# EAGLE design Gary-Repalcement (EAGLE 6.6.0)
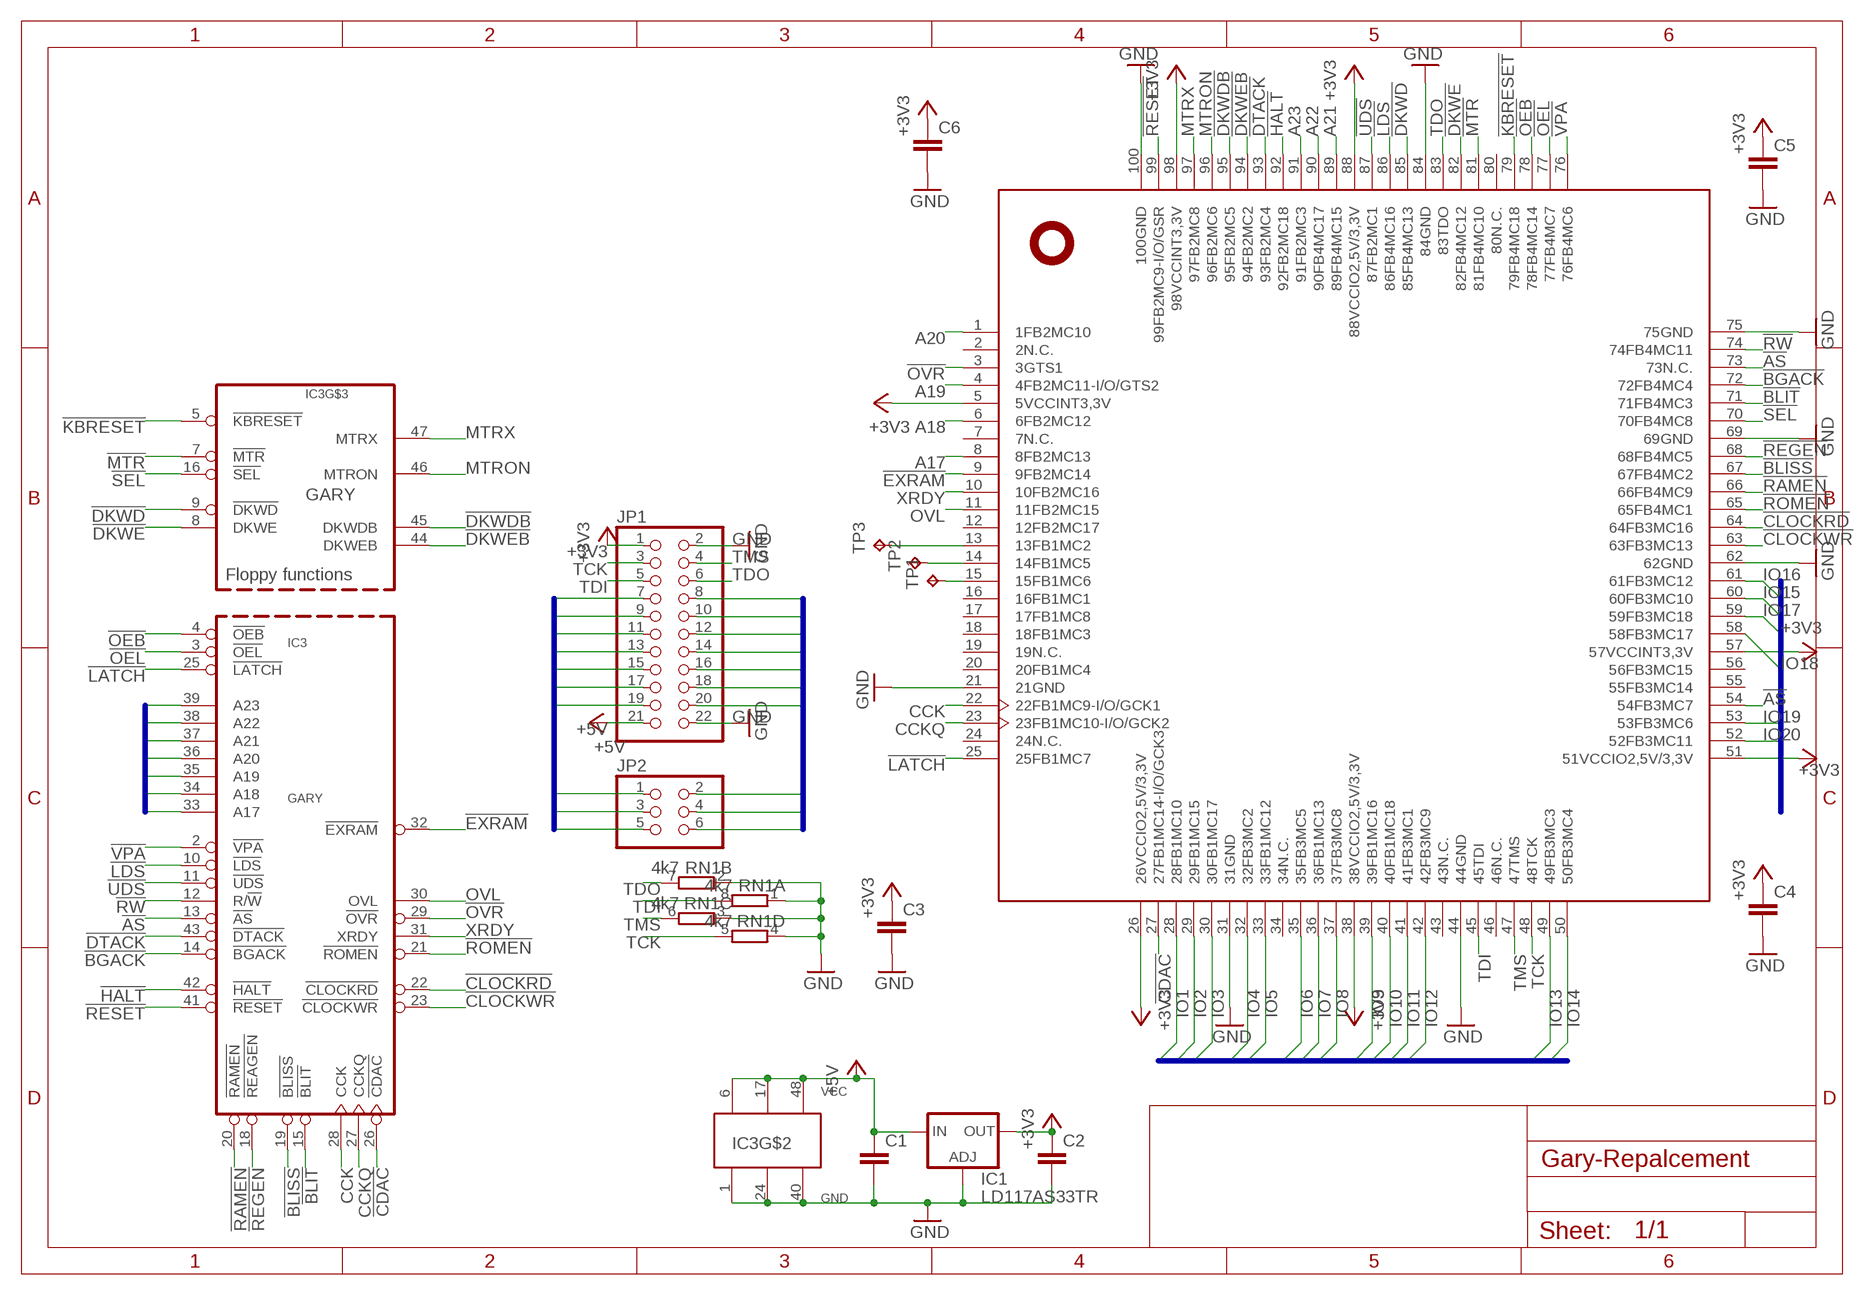
[diagram p0: schematic, sheet 1]

## Parts
C1  C-EUC0805K  [C0805K]
C2  C-EUC0805K  [C0805K]
C3  C-EUC0603  [C0603]
C4  C-EUC0603  [C0603]
C5  C-EUC0603  [C0603]
C6  C-EUC0603  [C0603]
IC1  LD117AS33TR  [SOT223]
IC2  XC9572XLTQ100  [TQ100]
IC3  GARY_DIP-LABELS  [DIP48-GARY]
JP1  PINHD-2X11  [2X11]
JP2  PINHD-2X3  [2X03]
RN1  4k7  4R-N0603-ARC  [0603-ARC]
TP1  TPB1,27  [B1,27]
TP2  TPB1,27  [B1,27]
TP3  TPB1,27  [B1,27]

## Nets
!AS: IC2.54(54FB3MC7) IC2.73(73N.C.) IC3.13(!AS)
!BGACK: IC2.72(72FB4MC4) IC3.14(!BGACK)
!BLISS: IC2.67(67FB4MC2) IC3.19(!BLISS)
!BLIT: IC2.71(71FB4MC3) IC3.15(!BLIT)
!CDAC: IC2.27(27FB1MC14-I/O/GCK3) IC3.26(!CDAC)
!CLOCKRD: IC2.64(64FB3MC16) IC3.22(!CLOCKRD)
!CLOCKWR: IC2.63(63FB3MC13) IC3.23(!CLOCKWR)
!DKWD: IC2.85(85FB4MC13) IC3.9(!DKWD)
!DKWDB: IC2.95(95FB2MC5) IC3.45(DKWDB)
!DKWE: IC2.82(82FB4MC12) IC3.8(DKWE)
!DKWEB: IC2.94(94FB2MC2) IC3.44(DKWEB)
!DTACK: IC2.93(93FB2MC4) IC3.43(!DTACK)
!EXRAM: IC2.9(9FB2MC14) IC3.32(!EXRAM)
!HALT: IC2.92(92FB2MC18) IC3.42(!HALT)
!KBRESET: IC2.79(79FB4MC18) IC3.5(!KBRESET)
!LATCH: IC2.25(25FB1MC7) IC3.25(!LATCH)
!LDS: IC2.86(86FB4MC16) IC3.10(!LDS)
!MTR: IC2.81(81FB4MC10) IC3.7(!MTR)
!OEB: IC2.78(78FB4MC14) IC3.4(!OEB)
!OEL: IC2.77(77FB4MC7) IC3.3(!OEL)
!OVR: IC2.3(3GTS1) IC3.29(!OVR)
!RAMEN: IC2.66(66FB4MC9) IC3.20(!RAMEN)
!REGEN: IC2.68(68FB4MC5) IC3.18(!REAGEN)
!RESET: IC2.99(99FB2MC9-I/O/GSR) IC3.41(!RESET)
!ROMEN: IC2.65(65FB4MC1) IC3.21(!ROMEN)
!RW: IC2.74(74FB4MC11) IC3.12(R/!W!)
!SEL: IC2.70(70FB4MC8) IC3.16(!SEL)
!UDS: IC2.87(87FB2MC1) IC3.11(!UDS)
!VPA: IC2.76(76FB4MC6) IC3.2(!VPA)
+3V3: C2.1 C3.1 C4.1 C5.1 C6.1 IC1.2(OUT) IC1.4(OUT) IC2.5(5VCCINT3,3V) IC2.26(26VCCIO2,5V/3,3V) IC2.38(38VCCIO2,5V/3,3V) IC2.51(51VCCIO2,5V/3,3V) IC2.57(57VCCINT3,3V) IC2.88(88VCCIO2,5V/3,3V) IC2.98(98VCCINT3,3V) JP1.1
+5V: C1.1 IC1.3(IN) IC3.6(VCC) IC3.17(VCC) IC3.48(VCC) JP1.21
A17: IC2.8(8FB2MC13) IC3.33(A17)
A18: IC2.6(6FB2MC12) IC3.34(A18)
A19: IC2.4(4FB2MC11-I/O/GTS2) IC3.35(A19)
A20: IC2.1(1FB2MC10) IC3.36(A20)
A21: IC2.89(89FB4MC15) IC3.37(A21)
A22: IC2.90(90FB4MC17) IC3.38(A22)
A23: IC2.91(91FB2MC3) IC3.39(A23)
CCK: IC2.22(22FB1MC9-I/O/GCK1) IC3.28(CCK)
CCKQ: IC2.23(23FB1MC10-I/O/GCK2) IC3.27(CCKQ)
GND: C1.2 C2.2 C3.2 C4.2 C5.2 C6.2 IC1.1(ADJ) IC2.21(21GND) IC2.31(31GND) IC2.44(44GND) IC2.62(62GND) IC2.69(69GND) IC2.75(75GND) IC2.84(84GND) IC2.100(100GND) IC3.1(GND) IC3.24(GND) IC3.40(GND) JP1.2 JP1.22 RN1.1 RN1.2 RN1.3 RN1.4
IO1: IC2.28(28FB1MC10) JP1.19
IO2: IC2.29(29FB1MC15) JP1.20
IO3: IC2.30(30FB1MC17) JP1.17
IO4: IC2.32(32FB3MC2) JP1.18
IO5: IC2.33(33FB1MC12) JP1.15
IO6: IC2.35(35FB3MC5) JP1.16
IO7: IC2.36(36FB1MC13) JP1.13
IO8: IC2.37(37FB3MC8) JP1.14
IO9: IC2.39(39FB1MC16) JP1.11
IO10: IC2.40(40FB1MC18) JP1.12
IO11: IC2.41(41FB3MC1) JP1.9
IO12: IC2.42(42FB3MC9) JP1.10
IO13: IC2.49(49FB3MC3) JP1.7
IO14: IC2.50(50FB3MC4) JP1.8
IO15: IC2.60(60FB3MC10) JP2.2
IO16: IC2.61(61FB3MC12) JP2.1
IO17: IC2.59(59FB3MC18) JP2.4
IO18: IC2.58(58FB3MC17) JP2.3
IO19: IC2.53(53FB3MC6) JP2.6
IO20: IC2.52(52FB3MC11) JP2.5
MTRON: IC2.96(96FB2MC6) IC3.46(MTRON)
MTRX: IC2.97(97FB2MC8) IC3.47(MTRX)
N$1: IC2.15(15FB1MC6) TP1.TP
N$2: IC2.14(14FB1MC5) TP2.TP
N$3: IC2.13(13FB1MC2) TP3.TP
OVL: IC2.11(11FB2MC15) IC3.30(OVL)
TCK: IC2.48(48TCK) JP1.3 RN1.5
TDI: IC2.45(45TDI) JP1.5 RN1.8
TDO: IC2.83(83TDO) JP1.6 RN1.7
TMS: IC2.47(47TMS) JP1.4 RN1.6
XRDY: IC2.10(10FB2MC16) IC3.31(XRDY)
Unconnected: IC2.2(2N.C.) IC2.7(7N.C.) IC2.12(12FB2MC17) IC2.16(16FB1MC1) IC2.17(17FB1MC8) IC2.18(18FB1MC3) IC2.19(19N.C.) IC2.20(20FB1MC4) IC2.24(24N.C.) IC2.34(34N.C.) IC2.43(43N.C.) IC2.46(46N.C.) IC2.55(55FB3MC14) IC2.56(56FB3MC15) IC2.80(80N.C.)

## Buses
A[1..23]
IO[1..20]

## Library data of the parts
C1-C6 = rcl:C-EU: CAPACITOR, European symbol
IC1 = v-reg:LD117A?*: Low drop fixed and adjustable positive voltage regulators 1 A Source: http://www.st.com/stonline/products/literature/ds/7194/ld1117axx.pdf
IC2 = xilinx_xc9572xl-tq100:XC9572XLTQ100
IC3 = Amiga:GARY
JP1 = pinhead:PINHD-2X11: PIN HEADER
JP2 = pinhead:PINHD-2X3: PIN HEADER
RN1 = resistor-dil:4R-N: Array Chip Resistor Source: RS Component / Phycomp; OC_FARNELL: unknown; OC_NEWARK: unknown
TP1-TP3 = testpad:TP: Test pad

## Board
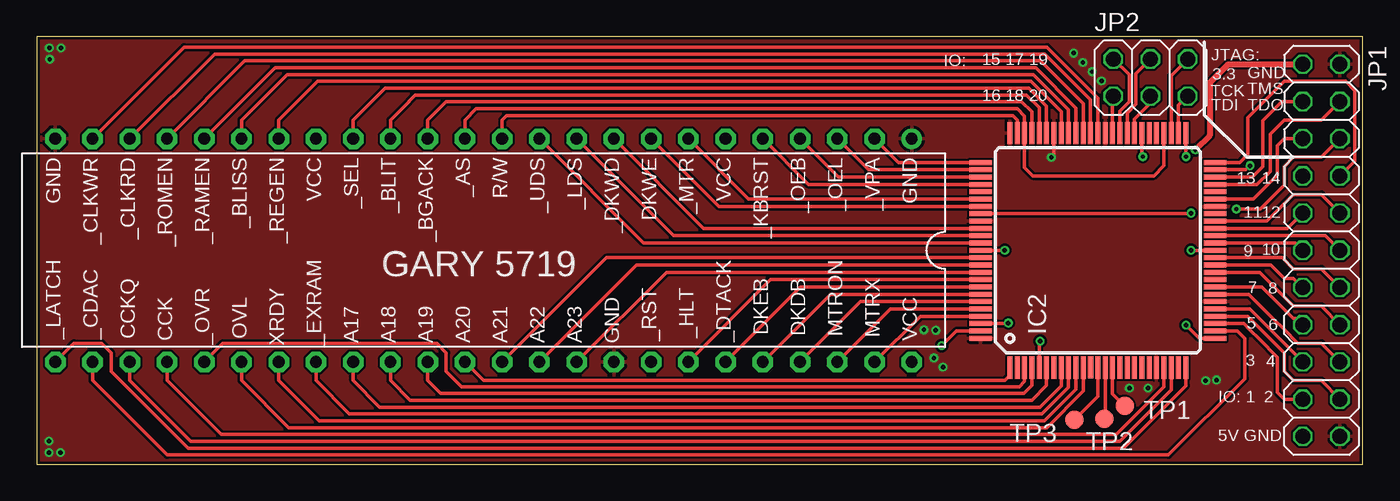
[diagram p1: board, top side]
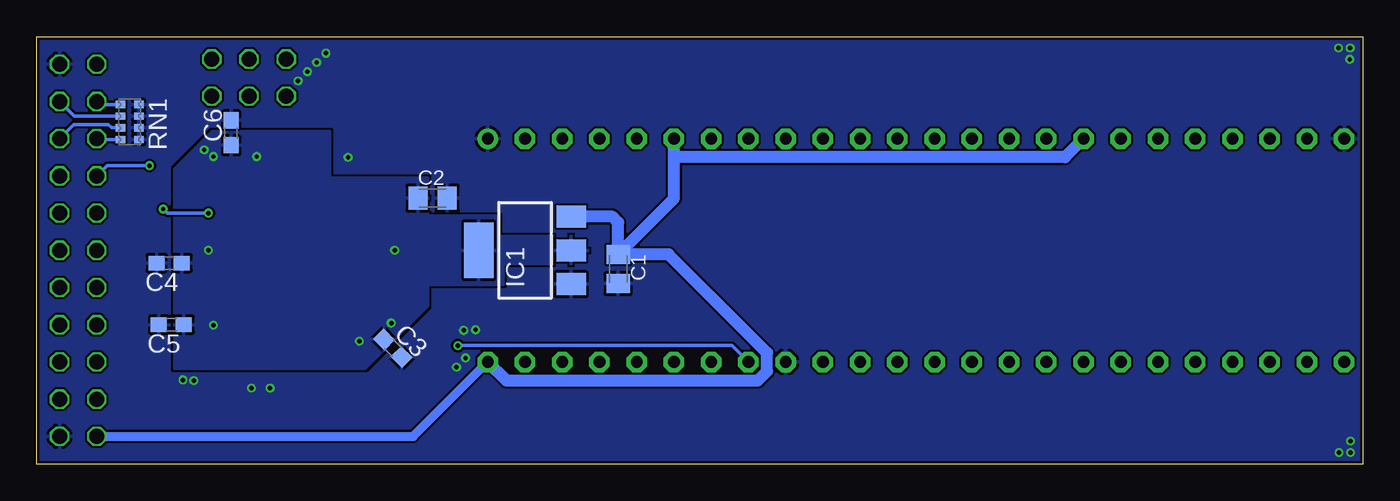
[diagram p2: board, bottom side, seen from below]

Size 90.46 x 29.19 mm. Coordinates in mm from the lower left corner, seen from the top.
Outline: 0,0 90.46,0 90.46,29.19 0,29.19 0,0
Copper layers (1*16): Top 0.035mm / dielectric 1.5mm / Bottom 0.035mm
Design rules "Eagle-DRU - 1506 - LeitOn - 01 and 02 layers - STANDARD": minimum track width 0.15mm, minimum drill 0.3mm, track to track 0.15mm, track to pad 0.15mm, pad to pad 0.15mm, via to via 0.15mm, smd to smd 0.15mm, copper to edge 0.2mm, drill to drill 0.25mm, minimum pad ring 0.15mm, minimum via ring 0.15mm, stop-mask expansion 0.05mm, vias tented up to drill 0mil, thermal gap 0.2mm

### Footprints (pad centres in the part's own frame; a part is rotated, then mirrored left to right if it is on the bottom)
C0805K = smd 1.3 x 1.6: 1 -1,0; 2 1,0
C0603 = smd 1.1 x 1: 1 -0.85,0; 2 0.85,0
SOT223 = smd 1.5 x 2: 1 -2.3,-3.15; 2 0,-3.15; 3 2.3,-3.15 | smd 3.8 x 2: 4 0,3.15
TQ100 = smd 1.524 x 0.343: 1 -4.19,3.46; 2 -4.19,2.96; 3 -4.19,2.46; 4 -4.19,1.96; 5 -4.19,1.46; 6 -4.19,0.96; 7 -4.19,0.46; 8 -4.19,-0.04; 9 -4.19,-0.54; 10 -4.19,-1.04; 11 -4.19,-1.54; 13 -4.19,-2.54; 14 -4.19,-3.04; 15 -4.19,-3.54; 16 -4.19,-4.04; 17 -4.19,-4.54; 18 -4.19,-5.04; 19 -4.19,-5.54; 20 -4.19,-6.04; 21 -4.19,-6.54; 22 -4.19,-7.04; 23 -4.19,-7.54; 24 -4.19,-8.04; 25 -4.19,-8.54; 51 11.81,-8.54; 52 11.81,-8.04; 53 11.81,-7.54; 54 11.81,-7.04; 55 11.81,-6.54; 56 11.81,-6.04; 57 11.81,-5.54; 58 11.81,-5.04; 59 11.81,-4.54; 60 11.81,-4.04; 61 11.81,-3.54; 62 11.81,-3.04; 63 11.81,-2.54; 64 11.81,-2.04; 65 11.81,-1.54; 66 11.81,-1.04; 67 11.81,-0.54; 68 11.81,-0.04; 69 11.81,0.46; 70 11.81,0.96; 71 11.81,1.46; 72 11.81,1.96; 73 11.81,2.46; 74 11.81,2.96; 75 11.81,3.46 | smd 1.5 x 0.35: 12 -4.19,-2.04 | smd 0.343 x 1.524: 26 -2.19,-10.54; 27 -1.69,-10.54; 28 -1.19,-10.54; 29 -0.69,-10.54; 30 -0.19,-10.54; 31 0.31,-10.54; 32 0.81,-10.54; 33 1.31,-10.54; 34 1.81,-10.54; 35 2.31,-10.54; 36 2.81,-10.54; 37 3.31,-10.54; 38 3.81,-10.54; 39 4.31,-10.54; 40 4.81,-10.54; 41 5.31,-10.54; 42 5.81,-10.54; 43 6.31,-10.54; 44 6.81,-10.54; 45 7.31,-10.54; 46 7.81,-10.54; 47 8.31,-10.54; 48 8.81,-10.54; 49 9.31,-10.54; 50 9.81,-10.54; 76 9.81,5.46; 77 9.31,5.46; 78 8.81,5.46; 79 8.31,5.46; 80 7.81,5.46; 81 7.31,5.46; 82 6.81,5.46; 83 6.31,5.46; 84 5.81,5.46; 85 5.31,5.46; 86 4.81,5.46; 87 4.31,5.46; 88 3.81,5.46; 89 3.31,5.46; 90 2.81,5.46; 91 2.31,5.46; 92 1.81,5.46; 93 1.31,5.46; 94 0.81,5.46; 95 0.31,5.46; 96 -0.19,5.46; 97 -0.69,5.46; 98 -1.19,5.46; 99 -1.69,5.46; 100 -2.19,5.46
DIP48-GARY = drill 0.8 pad 1.4: 1 -29.21,-7.62 | drill 0.8 pad 1.4 octagon: 2 -26.67,-7.62; 3 -24.13,-7.62; 4 -21.59,-7.62; 5 -19.05,-7.62; 6 -16.51,-7.62; 7 -13.97,-7.62; 8 -11.43,-7.62; 9 -8.89,-7.62; 10 -6.35,-7.62; 11 -3.81,-7.62; 12 -1.27,-7.62; 13 1.27,-7.62; 14 3.81,-7.62; 15 6.35,-7.62; 16 8.89,-7.62; 17 11.43,-7.62; 18 13.97,-7.62; 19 16.51,-7.62; 20 19.05,-7.62; 21 21.59,-7.62; 22 24.13,-7.62; 23 26.67,-7.62; 24 29.21,-7.62; 25 29.21,7.62; 26 26.67,7.62; 27 24.13,7.62; 28 21.59,7.62; 29 19.05,7.62; 30 16.51,7.62; 31 13.97,7.62; 32 11.43,7.62; 33 8.89,7.62; 34 6.35,7.62; 35 3.81,7.62; 36 1.27,7.62; 37 -1.27,7.62; 38 -3.81,7.62; 39 -6.35,7.62; 40 -8.89,7.62; 41 -11.43,7.62; 42 -13.97,7.62; 43 -16.51,7.62; 44 -19.05,7.62; 45 -21.59,7.62; 46 -24.13,7.62; 47 -26.67,7.62; 48 -29.21,7.62
2X11 = drill 1.016 octagon: 1 -12.7,-1.27; 2 -12.7,1.27; 3 -10.16,-1.27; 4 -10.16,1.27; 5 -7.62,-1.27; 6 -7.62,1.27; 7 -5.08,-1.27; 8 -5.08,1.27; 9 -2.54,-1.27; 10 -2.54,1.27; 11 0,-1.27; 12 0,1.27; 13 2.54,-1.27; 14 2.54,1.27; 15 5.08,-1.27; 16 5.08,1.27; 17 7.62,-1.27; 18 7.62,1.27; 19 10.16,-1.27; 20 10.16,1.27; 21 12.7,-1.27; 22 12.7,1.27
2X03 = drill 1.016 octagon: 1 -2.54,-1.27; 2 -2.54,1.27; 3 0,-1.27; 4 0,1.27; 5 2.54,-1.27; 6 2.54,1.27
0603-ARC = smd 0.5 x 0.65: 1 -1.2,-0.625; 2 -0.4,-0.625; 3 0.4,-0.625; 4 1.2,-0.625; 5 1.2,0.625; 6 0.4,0.625; 7 -0.4,0.625; 8 -1.2,0.625
B1,27 = smd 1.27 x 1.27: TP 0,0

### Placement (x,y rotation side)
C1  50.8,13.34 270 bottom
C2  63.46,18.17 0 bottom
C3  66.17,7.92 315 bottom
C4  81.42,13.73 180 bottom
C5  81.28,9.53 180 bottom
C6  77.19,22.63 90 bottom
IC1  57.15,14.61 90 bottom
IC2  69.85,10.79 90 top
IC3  30.48,14.61 180 top
JP1  87.63,14.61 270 top
JP2  75.97,26.39 0 top
RN1  84.12,23.36 90 bottom
TP1  74.22,3.98 0 top
TP2  72.82,3.11 0 top
TP3  70.8,3.05 0 top

### Tracks (layer width: path | path; a pad name or v marks a point on that pad's centre or on a via)
!AS
  Top 0.254: IC3.13 29.21,23.5 29.98,24.27 66.9,24.27 67.39,23.78 IC2.73 67.39,20.24 67.94,19.68 76.2,19.68 76.89,20.38 IC2.54
!BGACK
  Top 0.254: IC3.14 26.67,23.5 27.94,24.77 67.18,24.77 67.89,24.05 IC2.72
!BLISS
  Top 0.254: IC3.19 13.97,23.5 17.08,26.6 67.99,26.6 70.39,24.2 IC2.67
!BLIT
  Top 0.254: IC3.15 24.13,23.5 25.4,24.77 25.4,24.78 25.82,25.2 67.52,25.2 68.39,24.33 IC2.71
!CDAC
  Top 0.254: IC3.26 3.81,5.71 8.89,0.64 77.21,0.64 82.42,5.84 82.42,8.59 81.91,9.11 IC2.27
!CLOCKRD
  Top 0.254: IC3.22 12.13,28 68.76,28 71.89,24.88 IC2.64
!CLOCKWR
  Top 0.254: IC3.23 10.05,28.47 68.92,28.47 72.39,25 IC2.63
!DKWD
  Top 0.254: IC2.85 45.49,16.11 IC3.9
!DKWDB
  Top 0.254: IC2.95 56.19,11.11 IC3.45
!DKWE
  Top 0.254: IC3.8 46.53,17.61 IC2.82
!DKWEB
  Top 0.254: IC2.94 54.15,11.61 IC3.44
!DTACK
  Top 0.254: IC2.93 52.11,12.11 IC3.43
!EXRAM
  Top 0.254: IC2.9 70.39,5.24 68.58,3.44 21.33,3.44 19.05,5.71 IC3.32
!HALT
  Top 0.254: IC2.92 50.07,12.61 IC3.42
!KBRESET
  Top 0.254: IC3.5 52.65,19.11 IC2.79
!LATCH
  Top 0.254: IC3.25 2.54,8.26 4.45,8.26 5.08,7.62 5.08,6.35 10.33,1.1 74.13,1.1 78.39,5.37 IC2.25
!LDS
  Top 0.254: IC2.86 43.45,15.61 IC3.10
!MTR
  Top 0.254: IC3.7 48.57,18.11 IC2.81
!OEB
  Top 0.254: IC3.4 54.69,19.61 IC2.78
!OEL
  Top 0.254: IC3.3 56.73,20.11 IC2.77
!OVR
  Top 0.254: IC2.3 67.39,5.67 67.03,5.3 28.99,5.3 27.94,6.35 27.94,7.62 27.3,8.26 12.7,8.26 IC3.29
!RAMEN
  Top 0.254: IC3.20 16.27,27.07 68.14,27.07 70.89,24.32 IC2.66
!REGEN
  Top 0.254: IC3.18 16.51,23.5 19.15,26.14 67.83,26.14 69.89,24.08 IC2.68
!RESET  (via drill 0.3)
  Top 0.254: IC2.99 62.74,9.11 v61.74,8.1
  Bottom 0.254: v61.74,8.1 43.03,8.1 IC3.41
!ROMEN
  Top 0.254: IC3.21 14.2,27.54 68.45,27.54 71.39,24.6 IC2.65
!RW
  Top 0.254: IC2.74 66.89,23.5 66.59,23.8 32.06,23.8 31.75,23.5 IC3.12
!SEL
  Top 0.254: IC3.16 21.59,23.5 23.77,25.67 67.67,25.67 68.89,24.45 IC2.70
!UDS
  Top 0.254: IC2.87 41.41,15.11 IC3.11
!VPA
  Top 0.254: IC3.2 58.77,20.61 IC2.76
+3V3  (via drill 0.3)
  Top 0.254: IC2.98 66.23,9.61 v66.28,9.65 | v66.04,14.61 IC2.88 | IC2.5 68.39,8.34 v68.45,8.4 | v78.74,14.61 IC2.38 | IC2.51 78.39,21.02 v78.41,21 | v75.45,21 75.39,21.07 IC2.57 | IC2.26 79.3,8.61 v78.41,9.49
  Top 0.305: 78.41,22.62 IC2.51
  Top 0.406: JP1.1 81.28,27.3 80.01,26.04 80.01,22.45 v79.03,21.47
  pour Bottom: 63.79,16.96 63.79,19.54 70.48,19.54 70.48,22.7 78.48,22.71 81.05,20.14 81.05,6.53 68.06,6.53 63.79,10.8 63.79,12.29 58.65,12.29 58.65,13.69 52.9,13.69 52.9,15.56 58.96,15.56 58.96,16.96
+5V
  Bottom 0.61: JP1.21 64.77,1.91 IC3.48
  Bottom 0.813: C1.1 50.8,16.51 51.2,16.91 IC1.3 | C1.1 46.99,18.14 46.99,20.95 | 46.99,20.95 IC3.6 | IC3.17 20.32,20.95 46.99,20.95 | IC3.48 58.42,5.71 41.27,5.71 40.64,6.35 40.64,7.62 47.35,14.34 C1.1
A17
  Top 0.254: IC2.8 69.89,5.36 68.43,3.9 23.4,3.9 21.59,5.71 IC3.33
A18
  Top 0.254: IC2.6 68.89,5.39 67.87,4.37 25.48,4.37 24.13,5.71 IC3.34
A19
  Top 0.254: IC2.4 67.89,5.39 67.34,4.84 27.55,4.84 26.67,5.71 IC3.35
A20
  Top 0.254: IC3.36 30.48,5.71 66.04,5.71 66.39,6.07 IC2.1
A21
  Top 0.254: IC2.89 38.87,14.11 IC3.37
A22
  Top 0.254: IC2.90 40.91,13.61 IC3.38
A23
  Top 0.254: IC2.91 42.95,13.11 IC3.39
CCK
  Top 0.254: IC3.28 8.89,5.71 12.57,2.04 73.64,2.04 76.89,5.29 IC2.22
CCKQ
  Top 0.254: IC2.23 77.39,5.09 73.87,1.57 10.5,1.57 6.35,5.71 IC3.27
GND  (via drill 0.3)
  Top 0.254: IC2.69 69.39,21.13 v69.22,20.95
  other vias: 60.52,9.18 61.33,9.14 61.2,7.25 61.83,6.63 75.81,5.21 74.54,5.21 72.63,26.16 79.74,5.71 80.48,5.76 0.84,0.81 1.62,0.81 0.84,1.58 0.87,28.42 1.66,28.42 0.89,27.64 72,26.8 71.36,27.43 70.73,28.07
  pour Top: 0,0 90.54,0 90.54,29.09 0,29.09
  pour Bottom (rank 2): 0,0 90.54,0 90.54,29.09 0,29.09
IO1
  Top 0.254: IC2.28 82.33,9.61 82.75,9.18 83.39,8.56 84.63,7.31 84.63,4.9 85.09,4.45 JP1.19
IO2
  Top 0.254: IC2.29 82.61,10.11 83.38,9.34 84.01,8.69 85.09,7.61 85.09,6.35 85.72,5.71 87.63,5.71 JP1.20
IO3
  Top 0.254: IC2.30 82.74,10.61 JP1.17
IO4
  Top 0.254: IC2.32 82.67,11.61 84.31,9.97 85.09,9.2 86.04,8.26 87.63,8.26 JP1.18
IO5
  Top 0.254: IC2.33 83.57,12.11 85.72,9.96 85.93,9.96 JP1.15
IO6
  Top 0.254: IC2.35 83.42,13.11 85.72,10.79 87.63,10.79 JP1.16
IO7
  Top 0.254: IC2.36 84.19,13.61 85.09,12.7 85.72,12.7 JP1.13
IO8
  Top 0.254: IC2.37 84.95,14.11 85.72,13.34 87.63,13.34 JP1.14
IO9
  Top 0.254: IC2.39 85.86,15.11 JP1.11
IO10
  Top 0.254: IC2.40 87.9,15.61 JP1.12
IO11
  Top 0.254: IC2.41 85.32,16.11 JP1.9
IO12
  Top 0.254: IC2.42 83.92,16.61 85.72,18.41 87.63,18.41 JP1.10
IO13  (via drill 0.3)
  Top 0.254: IC2.49 82.49,20.11 v82.77,20.38
  Bottom 0.254: v82.77,20.38 85.67,20.38 JP1.7
IO14
  Top 0.254: IC2.50 82.06,20.61 82.61,21.16 82.61,23.65 85.1,26.14 89.3,26.14 89.92,25.51 89.92,20.71 JP1.8
IO15
  Top 0.254: IC2.60 73.89,24.11 74.52,24.74 74.52,26.58 JP2.2
IO16
  Top 0.254: IC2.61 73.39,25.08 JP2.1
IO17
  Top 0.254: IC2.59 74.39,23.98 74.99,24.58 74.99,26.68 JP2.4
IO18
  Top 0.254: IC2.58 74.89,23.55 75.97,24.64 JP2.3
IO19
  Top 0.254: IC2.53 77.39,26.54 JP2.6
IO20
  Top 0.254: IC2.52 77.89,24.5 JP2.5
MTRON
  Top 0.254: IC2.96 58.23,10.61 IC3.46
MTRX
  Top 0.254: IC2.97 60.27,10.11 IC3.47
N$1
  Top 0.254: IC2.15 73.39,4.81 TP1.TP
N$2
  Top 0.254: IC2.14 72.89,3.18 TP2.TP
N$3
  Top 0.254: IC2.13 72.39,4.64 TP3.TP
OVL
  Top 0.254: IC2.11 71.39,5 68.89,2.5 17.18,2.5 13.97,5.71 IC3.30
TCK
  Top 0.254: IC2.48 82.94,19.61 83.65,20.32 83.65,23.47 84.94,24.77 JP1.3
  Bottom 0.254: RN1.5 86.16,24.57 JP1.3
TDI
  Top 0.254: IC2.45 82.98,18.11 84.62,19.75 84.62,21.74 84.61,21.75 85.09,22.23 JP1.5
  Bottom 0.254: RN1.8 86.3,22.16 JP1.5
TDO  (via drill 0.3)
  Top 0.254: IC2.83 78.7,17.11 v78.74,17.14 | JP1.6 87.63,20.95 85.72,20.95 85.09,20.32 85.09,19.05 83.46,17.42 v81.83,17.42
  Bottom 0.254: v78.74,17.14 81.55,17.14 v81.83,17.42 | RN1.7 85.35,22.96 85.57,23.18 87.94,23.18 JP1.6
TMS
  Top 0.254: IC2.47 83.24,19.11 84.13,20 84.13,22.52 85.1,23.49 87.63,23.49 JP1.4
  Bottom 0.254: RN1.6 87.9,23.77 JP1.4
XRDY
  Top 0.254: IC2.10 70.89,5.12 68.74,2.97 19.26,2.97 16.51,5.71 IC3.31

### Text on the board
tNames: JTAG: | IO: | 3.3 | GND | 15 17 19 / / 16 18 20 | TCK | TMS | TDI | TDO | 13 | 14 | 11 | 12 | 9 | 10 | 7 | 8 | 5 | 6 | 3 | 4 | IO: | 1 | 2 | 5V GND